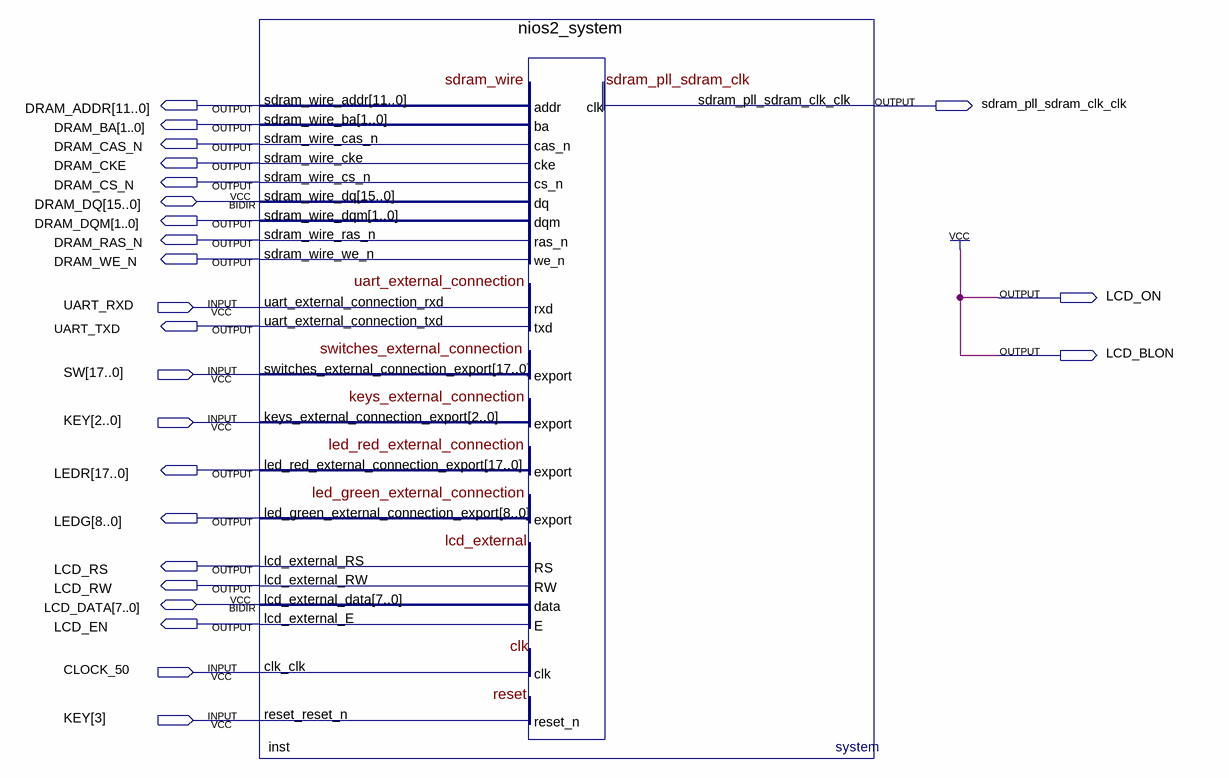
[diagram p0: schematic sheet]
// Quartus schematic lab1.bdf as structural Verilog: 1 symbols, 24 pins
module lab1 (
  input  UART_RXD,
  input  [17:0] SW,
  input  [3:0] KEY,
  input  CLOCK_50,
  inout  [15:0] DRAM_DQ,
  inout  [7:0] LCD_DATA,
  output [11:0] DRAM_ADDR,
  output sdram_pll_sdram_clk_clk,
  output [1:0] DRAM_BA,
  output DRAM_CAS_N,
  output DRAM_CKE,
  output DRAM_CS_N,
  output [1:0] DRAM_DQM,
  output DRAM_RAS_N,
  output DRAM_WE_N,
  output LCD_ON,
  output UART_TXD,
  output LCD_BLON,
  output [17:0] LEDR,
  output [8:0] LEDG,
  output LCD_RS,
  output LCD_RW,
  output LCD_EN
);

  nios2_system inst (
    .uart_external_connection_rxd(UART_RXD), .switches_external_connection_export(SW),
    .keys_external_connection_export(KEY[2:0]), .clk_clk(CLOCK_50), .reset_reset_n(KEY[3]),
    .sdram_wire_addr(DRAM_ADDR), .sdram_wire_ba(DRAM_BA), .sdram_wire_cas_n(DRAM_CAS_N),
    .sdram_wire_cke(DRAM_CKE), .sdram_wire_cs_n(DRAM_CS_N), .sdram_wire_dqm(DRAM_DQM),
    .sdram_wire_ras_n(DRAM_RAS_N), .sdram_wire_we_n(DRAM_WE_N), .uart_external_connection_txd(UART_TXD),
    .led_red_external_connection_export(LEDR), .led_green_external_connection_export(LEDG),
    .lcd_external_RS(LCD_RS), .lcd_external_RW(LCD_RW), .lcd_external_E(LCD_EN),
    .sdram_pll_sdram_clk_clk(sdram_pll_sdram_clk_clk), .sdram_wire_dq(DRAM_DQ), .lcd_external_data(LCD_DATA));

  assign LCD_BLON = 1'b1;
  assign LCD_ON = 1'b1;
endmodule
